# EAGLE design MD_02_SCHM (EAGLE 9.5.1)
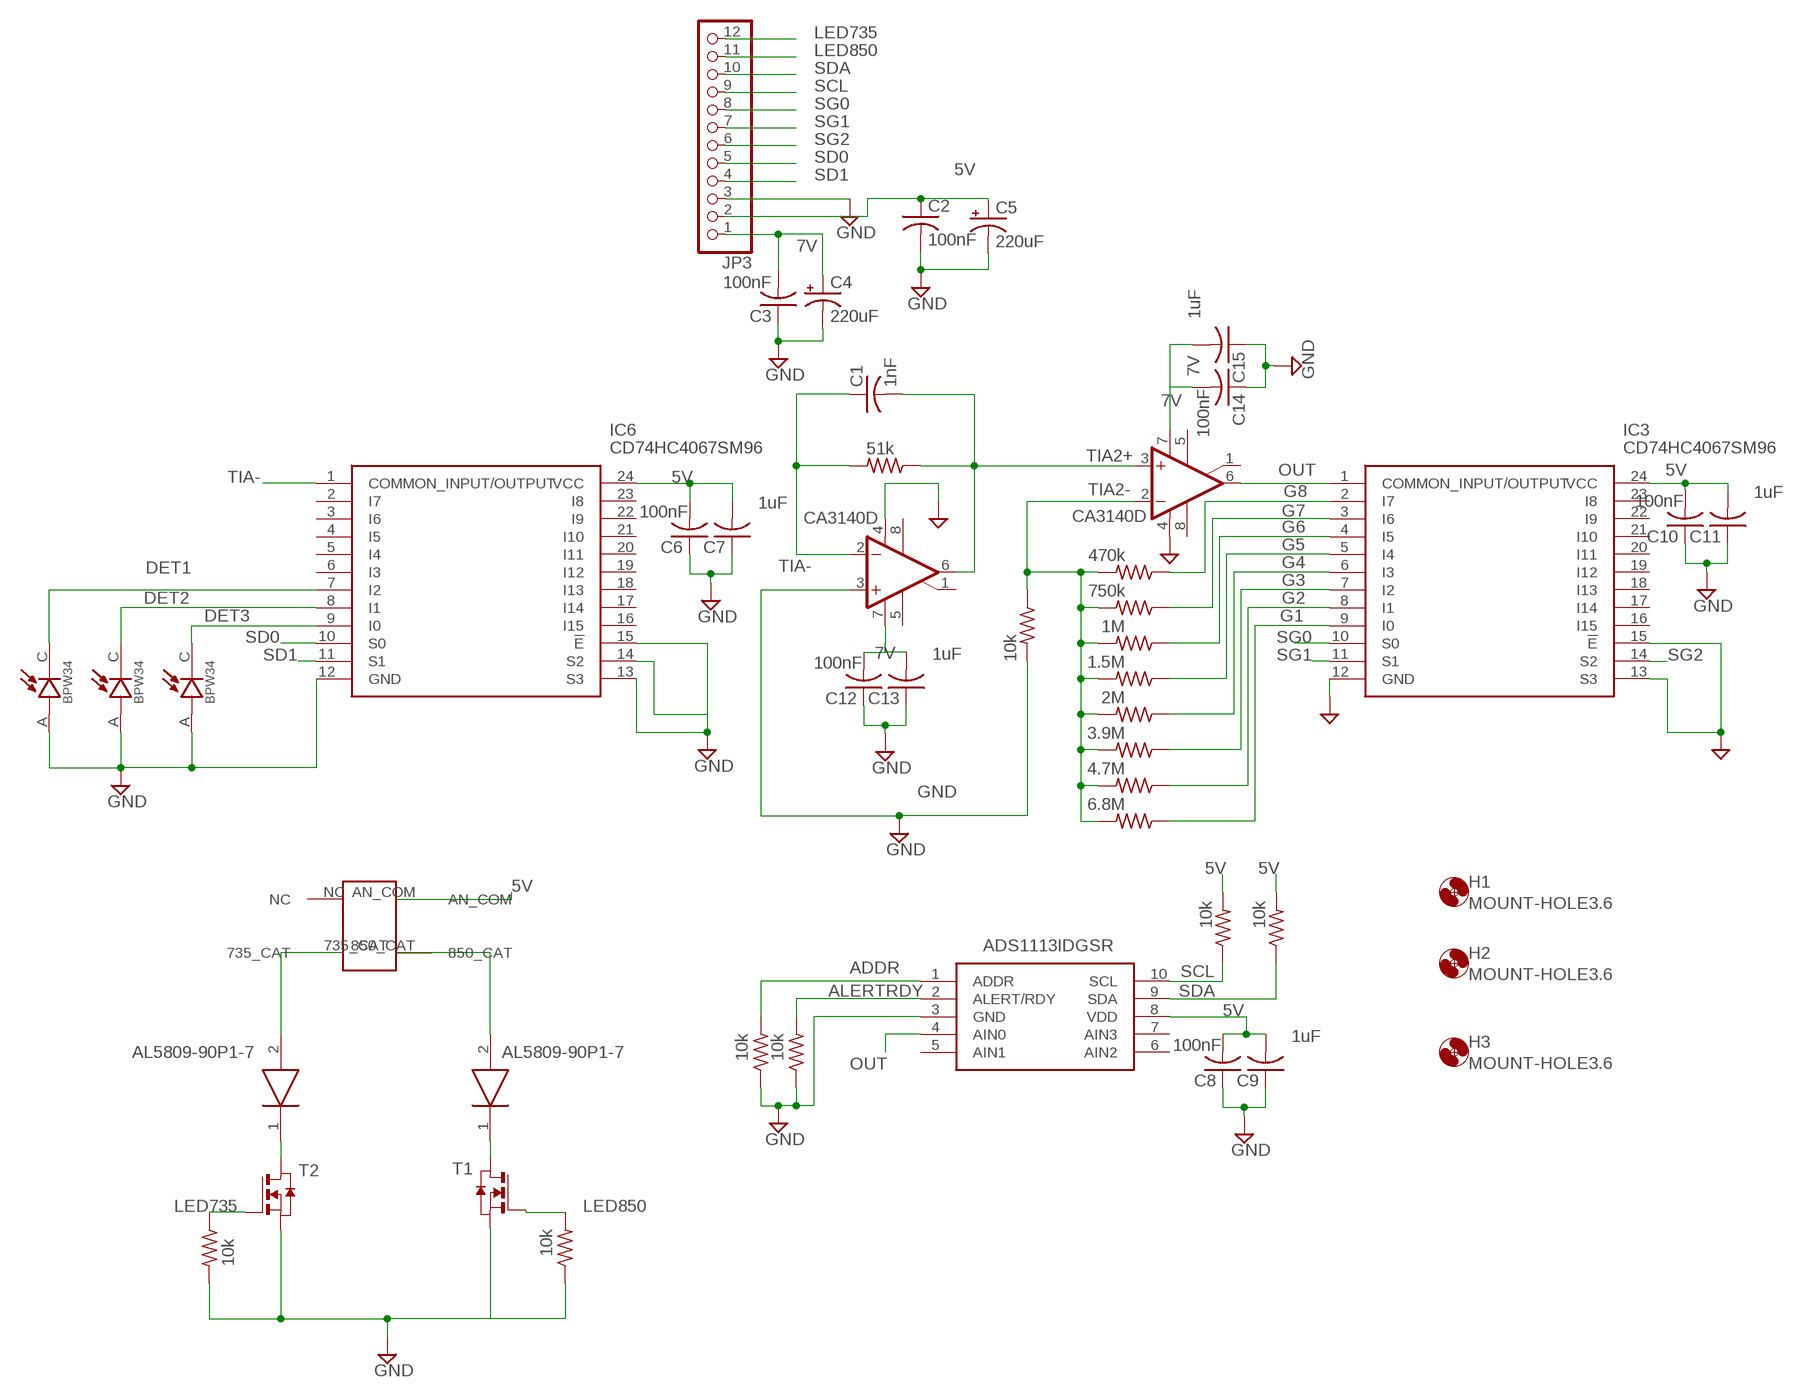
[diagram p0: schematic, sheet 1]

## Parts
C1  1nF  C-USC0805  [C0805]
C2  100nF  C-USC0805  [C0805]
C3  100nF  C-USC0805  [C0805]
C4  220uF  CPOL-USE5-6  [E5-6]
C5  220uF  CPOL-USE5-6  [E5-6]
C6  100nF  C-USC0805  [C0805]
C7  1uF  C-USC0805  [C0805]
C8  100nF  C-USC0805  [C0805]
C9  1uF  C-USC0805  [C0805]
C10  100nF  C-USC0805  [C0805]
C11  1uF  C-USC0805  [C0805]
C12  100nF  C-USC0805  [C0805]
C13  1uF  C-USC0805  [C0805]
C14  100nF  C-USC0805  [C0805]
C15  1uF  C-USC0805  [C0805]
D1  AL5809-90P1-7  [SODFL3718X100N]
D2  BPW34  [DIO_BPW34]
D3  BPW34  [DIO_BPW34]
D4  BPW34  [DIO_BPW34]
D5  AL5809-90P1-7  [SODFL3718X100N]
H1  MOUNT-HOLE3.6  [3,6]
H2  MOUNT-HOLE3.6  [3,6]
H3  MOUNT-HOLE3.6  [3,6]
IC1  CA3140D  [SO08]
IC2  CA3140D  [SO08]
IC3  CD74HC4067SM96  [SOP65P780X200-24N]
IC5  ADS1113IDGSR  [SOP50P490X110-10N]
IC6  CD74HC4067SM96  [SOP65P780X200-24N]
JP3  PINHD-1X12  [1X12]
R1  51k  R-US_R0805  [R0805]
R2  10k  R-US_R0805  [R0805]
R3  470k  R-US_R0805  [R0805]
R4  750k  R-US_R0805  [R0805]
R5  1M  R-US_R0805  [R0805]
R6  1.5M  R-US_R0805  [R0805]
R7  2M  R-US_R0805  [R0805]
R8  3.9M  R-US_R0805  [R0805]
R9  4.7M  R-US_R0805  [R0805]
R10  6.8M  R-US_R0805  [R0805]
R11  10k  R-US_R0805  [R0805]
R12  10k  R-US_R0805  [R0805]
R13  10k  R-US_R0805  [R0805]
R14  10k  R-US_R0805  [R0805]
R15  10k  R-US_R0805  [R0805]
R16  10k  R-US_R0805  [R0805]
T1  NMOSSOT23  [SOT-23]
T2  NMOSSOT23  [SOT-23]
U$1  SMT735D_850D  [SMT735D_850D]

## Nets
5V: C2.1 C5.+ C6.2 C7.2 C8.2 C9.2 C10.2 C11.2 IC3.24(VCC) IC5.8(VDD) IC6.24(VCC) JP3.2 R13.2 R14.2 U$1.AN_COM
7V: C3.2 C4.+ C12.2 C13.2 C14.2 C15.2 IC1.7(V+) IC2.7(V+) JP3.1
ADDR: IC5.1(ADDR) R11.2
ALERTRDY: IC5.2(ALERT/RDY) R12.2
DET1: D2.C IC6.7(I2)
DET2: D3.C IC6.8(I1)
DET3: D4.C IC6.9(I0)
G1: IC3.9(I0) R10.1
G2: IC3.8(I1) R9.1
G3: IC3.7(I2) R8.1
G4: IC3.6(I3) R7.1
G5: IC3.5(I4) R6.1
G6: IC3.4(I5) R5.1
G7: IC3.3(I6) R4.1
G8: IC3.2(I7) R3.1
GND: C2.2 C3.1 C4.- C5.- C6.1 C7.1 C8.1 C9.1 C10.1 C11.1 C12.1 C13.1 C14.1 C15.1 D2.A D3.A D4.A IC1.3(+IN) IC1.4(V-) IC2.4(V-) IC3.12(GND) IC3.13(S3) IC3.15(!E) IC5.3(GND) IC6.12(GND) IC6.13(S3) IC6.14(S2) IC6.15(!E) JP3.3 R2.2 R11.1 R12.1 R15.2 R16.1 T1.2(S) T2.2(S)
LED735: JP3.12 R15.1 T2.3(G)
LED850: JP3.11 R16.2 T1.3(G)
N$1: D5.1(K) T2.1(D)
N$2: D1.1(K) T1.1(D)
N$3: D1.2(A) U$1.850_CAT
N$4: D5.2(A) U$1.735_CAT
OUT: IC2.6(OUT) IC3.1(COMMON_INPUT/OUTPUT) IC5.4(AIN0)
SCL: IC5.10(SCL) JP3.9 R13.1
SD0: IC6.10(S0) JP3.5
SD1: IC6.11(S1) JP3.4
SDA: IC5.9(SDA) JP3.10 R14.1
SG0: IC3.10(S0) JP3.8
SG1: IC3.11(S1) JP3.7
SG2: IC3.14(S2) JP3.6
TIA2+: C1.2 IC1.6(OUT) IC2.3(+IN) R1.1
TIA2-: IC2.2(-IN) R2.1 R3.2 R4.2 R5.2 R6.2 R7.2 R8.2 R9.2 R10.2
TIA-: C1.1 IC1.2(-IN) IC6.1(COMMON_INPUT/OUTPUT) R1.2
Unconnected: IC1.1(ON/CMP) IC1.5(ON) IC1.8(CMP) IC2.1(ON/CMP) IC2.5(ON) IC2.8(CMP) IC3.16(I15) IC3.17(I14) IC3.18(I13) IC3.19(I12) IC3.20(I11) IC3.21(I10) IC3.22(I9) IC3.23(I8) IC5.5(AIN1) IC5.6(AIN2) IC5.7(AIN3) IC6.2(I7) IC6.3(I6) IC6.4(I5) IC6.5(I4) IC6.6(I3) IC6.16(I15) IC6.17(I14) IC6.18(I13) IC6.19(I12) IC6.20(I11) IC6.21(I10) IC6.22(I9) IC6.23(I8) U$1.NC

## Library data of the parts
C1-C3 C6-C15 = rcl:C-US: CAPACITOR, American symbol; SPICEPREFIX: C
C4 C5 = rcl:CPOL-US: POLARIZED CAPACITOR, American symbol; SPICEPREFIX: C
D1 D5 = AL5809-90P1-7:AL5809-90P1-7: 60V Two Terminal LED Driver PowerDI 123 DiodesZetex AL5809-90P1-7 LED Driver IC, 60 V 94.5mA 2-Pin PDI-123 Source: Datasheet <https://www.diodes.com/assets/Datasheets/AL5809.pdf>; ARROW_PART_NUMBER: AL5809-90P1-7; ARROW_PRICE-STOCK: https://www.arrow.com/en/products/al5809-90p1-7/diodes-incorporated; DESCRIPTION: 60V Two Terminal LED Driver PowerDI 123 DiodesZetex AL5809-90P1-7 LED Driver IC, 60 V 94.5mA 2-Pin PDI-123; HEIGHT: 1mm; MANUFACTURER_NAME: Diodes Inc.; MANUFACTURER_PART_NUMBER: AL5809-90P1-7; MOUSER_PART_NUMBER: 621-AL5809-90P1-7; MOUSER_PRICE-STOCK: https://www.mouser.co.uk/ProductDetail/Diodes-Incorporated/AL5809-90P1-7?qs=9BjnSzo86S8buMV1uNzOdA%3D%3D
D2-D4 = BPW34:BPW34: PIN IR photodiode; DIL; 400-1100nm; 150mW; 60°; λp max:; AVAILABILITY: Unavailable; DESCRIPTION: Photodiode 900nm 130° 2-DIP; MF: Vishay Semiconductor; MP: BPW34; PACKAGE: DIP-2 Osram Opto; PRICE: None
H1-H3 = holes:MOUNT-HOLE: MOUNTING HOLE with drill center marker
IC1 IC2 = linear:CA3140: OP AMP
IC3 IC6 = CD74HC4067SM96:CD74HC4067SM96: High Speed CMOS 16-Ch MUX/DEMUX 24P SOIC CD74HC4067SM96, Multiplexer/Demultiplexer Single 16:1, 3 V, 5 V, 24-Pin, SSOP, 1 Source: Datasheet <http://docs-emea.rs-online.com/webdocs/0c95/0900766b80c95708.pdf>; ARROW_PART_NUMBER: CD74HC4067SM96; ARROW_PRICE-STOCK: https://www.arrow.com/en/products/cd74hc4067sm96/texas-instruments?region=nac; DESCRIPTION: High Speed CMOS 16-Ch MUX/DEMUX 24P SOIC CD74HC4067SM96, Multiplexer/Demultiplexer Single 16:1, 3 V, 5 V, 24-Pin, SSOP, 1; HEIGHT: 2mm; MANUFACTURER_NAME: Texas Instruments; MANUFACTURER_PART_NUMBER: CD74HC4067SM96; MOUSER_PART_NUMBER: 595-CD74HC4067SM96; MOUSER_PRICE-STOCK: https://www.mouser.co.uk/ProductDetail/Texas-Instruments/CD74HC4067SM96?qs=JHHQeKcAU3DyfvAOSRLjhQ%3D%3D
IC5 = ADS1113IDGSR:ADS1113IDGSR: 16-Bit 860SPS 1-Ch Delta-Sigma ADC With Oscillator, Voltage Reference, and I2C Source: Datasheet <http://www.ti.com/lit/gpn/ADS1113>; ARROW_PART_NUMBER: ADS1113IDGSR; ARROW_PRICE-STOCK: https://www.arrow.com/en/products/ads1113idgsr/texas-instruments; DESCRIPTION: 16-Bit 860SPS 1-Ch Delta-Sigma ADC With Oscillator, Voltage Reference, and I2C; HEIGHT: 1.1mm; MANUFACTURER_NAME: Texas Instruments; MANUFACTURER_PART_NUMBER: ADS1113IDGSR; MOUSER_PART_NUMBER: 595-ADS1113IDGSR; MOUSER_PRICE-STOCK: https://www.mouser.co.uk/ProductDetail/Texas-Instruments/ADS1113IDGSR?qs=IK5e5L0zOXhAIF5uflVd8Q%3D%3D
JP3 = pinhead:PINHD-1X12: PIN HEADER
R1-R16 = rcl:R-US_: RESISTOR, American symbol; SPICEPREFIX: R
T1 T2 = zetex:NMOSSOT23: MOS FET; OC_FARNELL: unknown; OC_NEWARK: unknown
U$1 = SMT735D_850D:SMT735D_850D

## Board
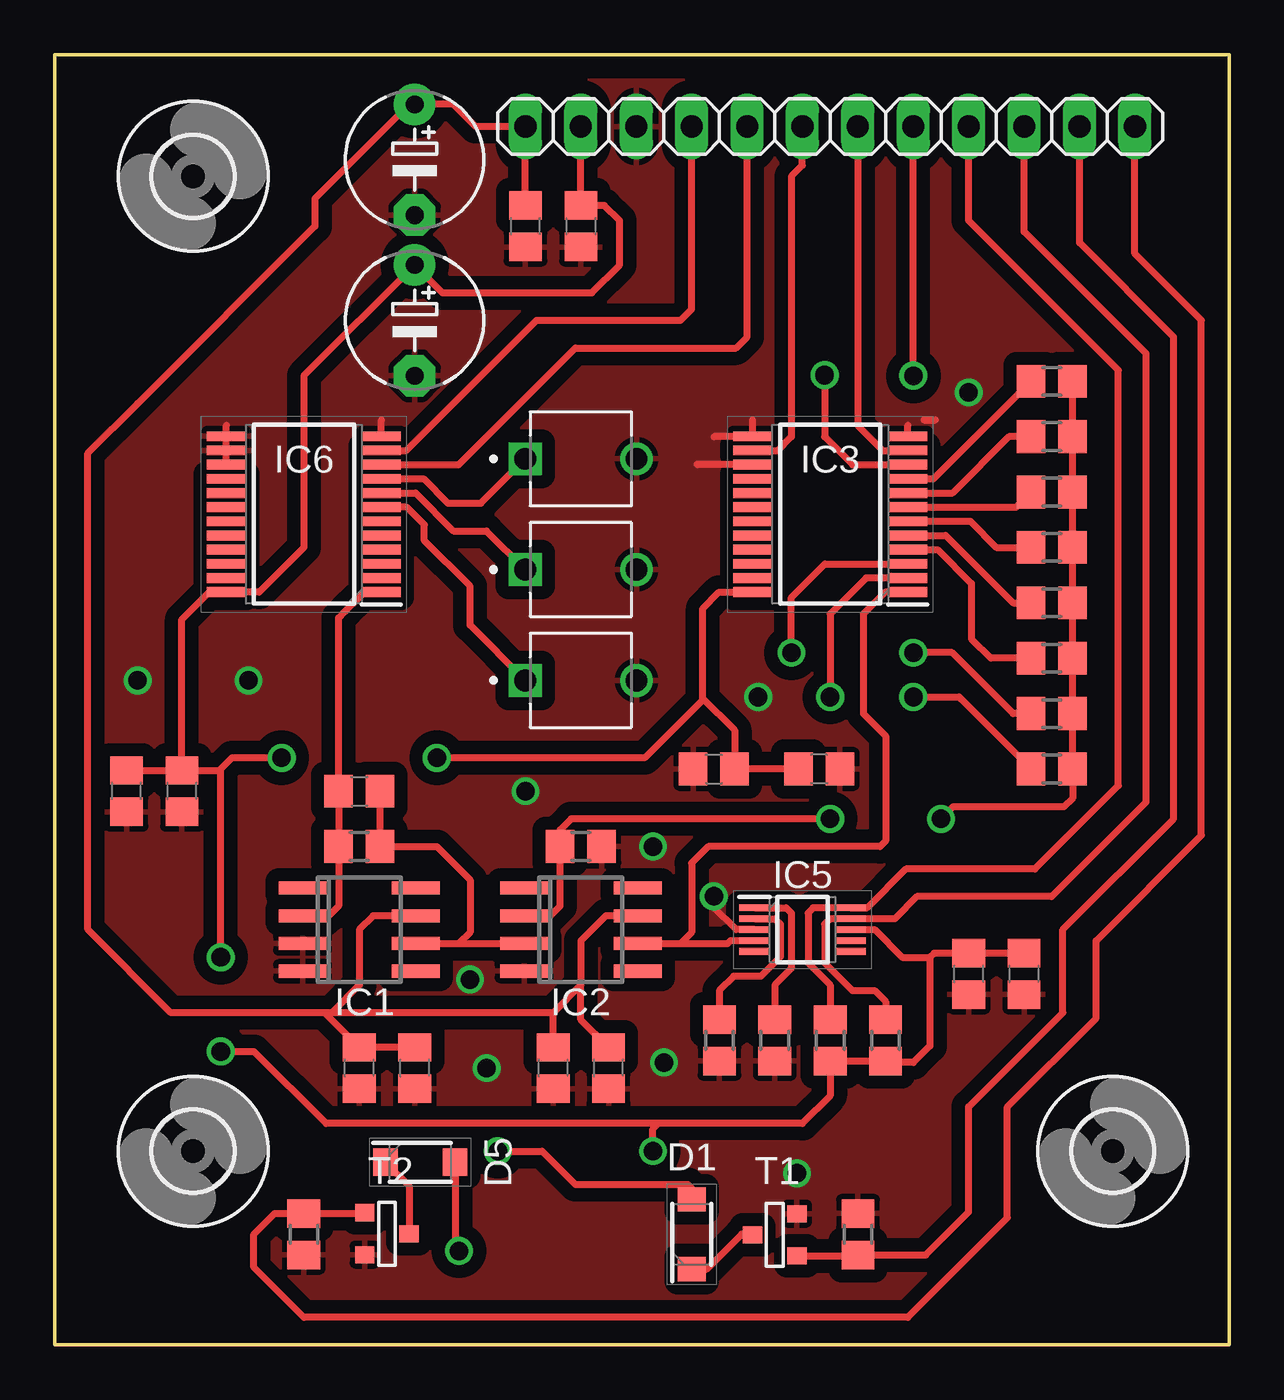
[diagram p1: board, top side]
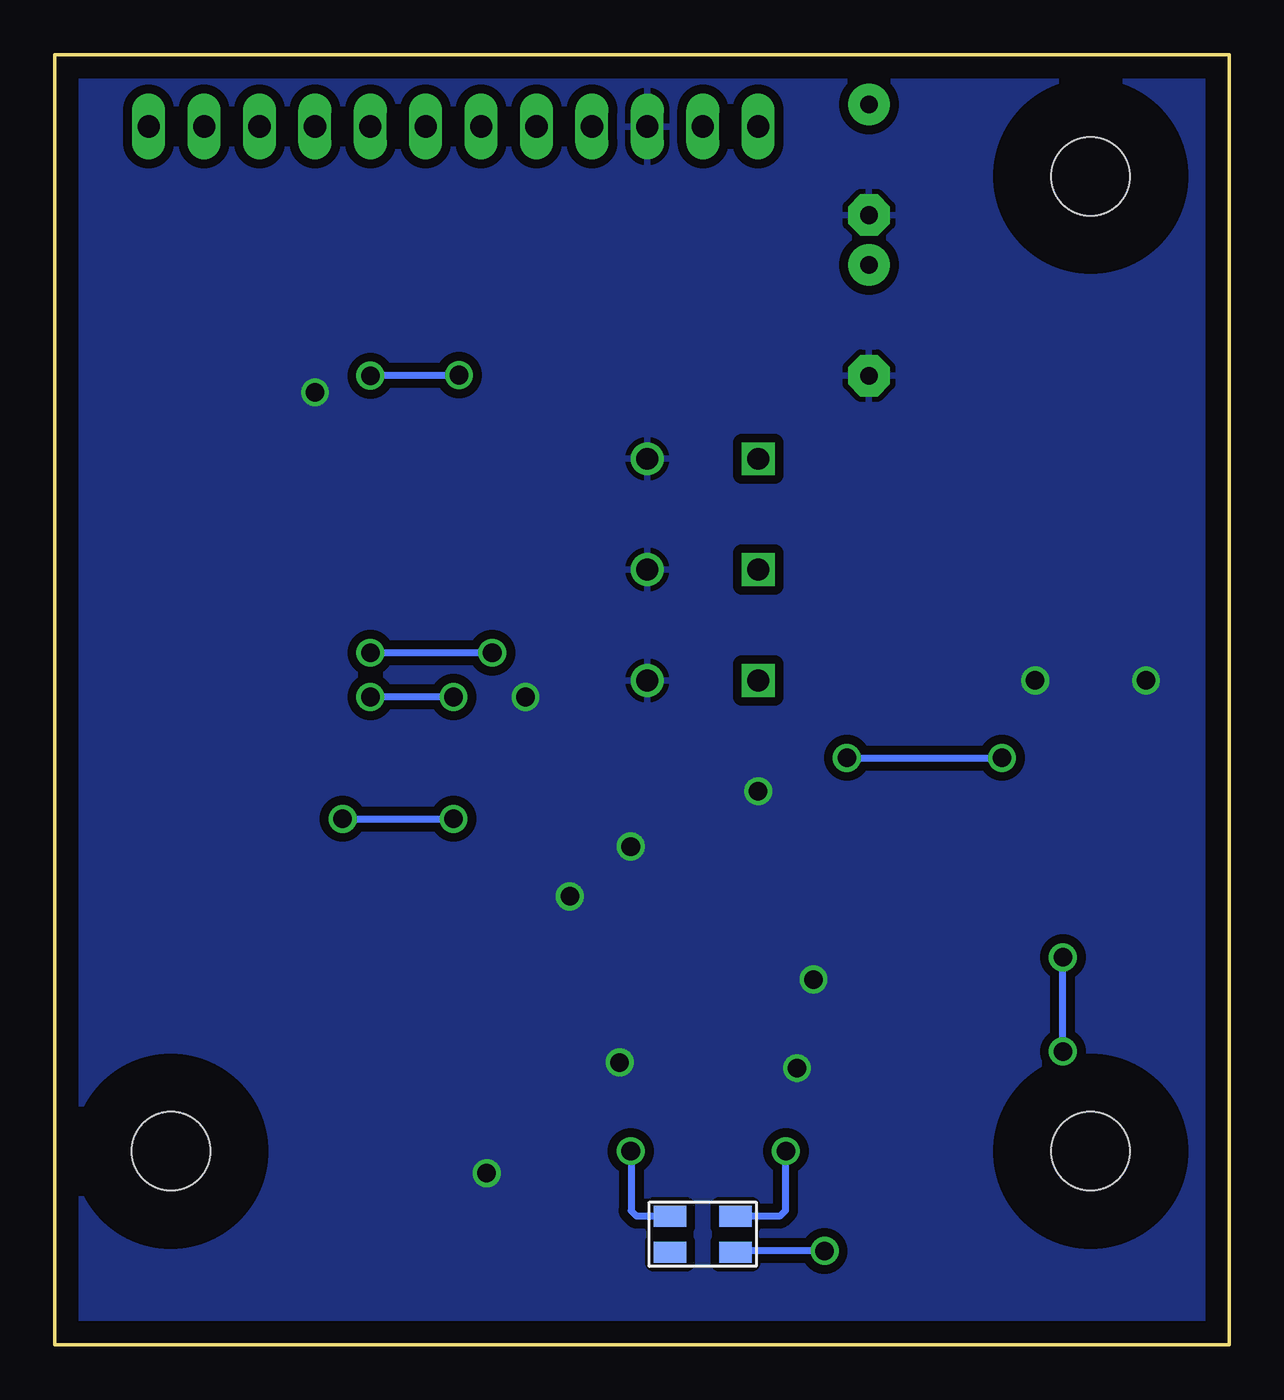
[diagram p2: board, bottom side, seen from below]

Size 53.85 x 59.18 mm. Coordinates in mm from the lower left corner, seen from the top.
Outline: 0,0 53.85,0 53.85,59.18 0,59.18 0,0
Copper layers (1*16): Top 0.035mm / dielectric 1.5mm / Bottom 0.035mm
Design rules "default": minimum track width 6mil, minimum drill 0.35mm, track to track 6mil, track to pad 6mil, pad to pad 6mil, via to via 6mil, smd to smd 6mil, copper to edge 40mil, drill to drill 6mil, minimum pad ring 10mil, minimum via ring 8mil, stop-mask expansion 4mil, vias tented up to drill 0mil, thermal gap 10mil

### Footprints (pad centres in the part's own frame; a part is rotated, then mirrored left to right if it is on the bottom)
C0805 = smd 1.3 x 1.5: 1 -0.95,0; 2 0.95,0
E5-6 = drill 0.813 pad 1.905: + -2.54,0 | drill 0.813 pad 1.905 octagon: - 2.54,0
SODFL3718X100N = smd 1.12 x 1.27: 1 -1.6,0; 2 1.6,0
DIO_BPW34 = drill 1 pad 1.5: A 2.55,0 | drill 1 pad 1.5 square: C -2.55,0
3,6 = hole 3.6: 0,0
SO08 = smd 0.6 x 2.2: 1 -1.905,-2.6; 2 -0.635,-2.6; 3 0.635,-2.6; 4 1.905,-2.6; 5 1.905,2.6; 6 0.635,2.6; 7 -0.635,2.6; 8 -1.905,2.6
SOP65P780X200-24N = smd 1.8 x 0.45: 1 -3.55,3.575; 2 -3.55,2.925; 3 -3.55,2.275; 4 -3.55,1.625; 5 -3.55,0.975; 6 -3.55,0.325; 7 -3.55,-0.325; 8 -3.55,-0.975; 9 -3.55,-1.625; 10 -3.55,-2.275; 11 -3.55,-2.925; 12 -3.55,-3.575; 13 3.55,-3.575; 14 3.55,-2.925; 15 3.55,-2.275; 16 3.55,-1.625; 17 3.55,-0.975; 18 3.55,-0.325; 19 3.55,0.325; 20 3.55,0.975; 21 3.55,1.625; 22 3.55,2.275; 23 3.55,2.925; 24 3.55,3.575
SOP50P490X110-10N = smd 1.4 x 0.3: 1 -2.2,1; 2 -2.2,0.5; 3 -2.2,0; 4 -2.2,-0.5; 5 -2.2,-1; 6 2.2,-1; 7 2.2,-0.5; 8 2.2,0; 9 2.2,0.5; 10 2.2,1
1X12 = drill 1.016 long: 1 -13.97,0; 2 -11.43,0; 3 -8.89,0; 4 -6.35,0; 5 -3.81,0; 6 -1.27,0; 7 1.27,0; 8 3.81,0; 9 6.35,0; 10 8.89,0; 11 11.43,0; 12 13.97,0
R0805 = smd 1.3 x 1.5: 1 -0.95,0; 2 0.95,0
SOT-23 = smd 0.787 x 0.889: 1 0.025,-1.016; 2 -0.94,1.016; 3 0.991,1.016
SMT735D_850D = smd 0.95 x 1.5: 735_CAT -0.825,-1.497; 850_CAT 0.825,-1.497; AN_COM 0.825,1.503; NC -0.825,1.503

### Placement (x,y rotation side)
C1  13.97,25.4 0 top
C2  24.13,51.31 270 top
C3  21.59,51.31 90 top
C4  16.51,54.36 270 top
C5  16.51,46.99 270 top
C6  5.84,25.4 90 top
C7  3.3,25.4 90 top
C8  41.91,17.02 90 top
C9  44.45,17.02 90 top
C10  30.23,26.42 0 top
C11  35.05,26.42 180 top
C12  16.51,12.7 90 top
C13  13.97,12.7 90 top
C14  25.4,12.7 90 top
C15  22.86,12.7 90 top
D1  29.21,5.08 90 top
D2  24.13,30.48 0 top
D3  24.13,35.56 0 top
D4  24.13,40.64 0 top
D5  16.76,8.38 0 top
H1  48.51,8.89 0 top
H2  6.35,8.89 0 top
H3  6.35,53.59 0 top
IC1  13.97,19.05 270 top
IC2  24.13,19.05 270 top
IC3  35.56,38.1 180 top
IC5  34.29,19.05 0 top
IC6  11.43,38.1 180 top
JP3  35.56,55.88 0 top
R1  13.97,22.86 180 top
R2  24.13,22.86 0 top
R3  45.72,26.42 0 top
R4  45.72,28.96 0 top
R5  45.72,31.5 0 top
R6  45.72,34.04 0 top
R7  45.72,36.58 0 top
R8  45.72,39.12 0 top
R9  45.72,41.66 0 top
R10  45.72,44.2 0 top
R11  33.02,13.97 90 top
R12  30.48,13.97 90 top
R13  35.56,13.97 270 top
R14  38.1,13.97 270 top
R15  11.43,5.08 270 top
R16  36.83,5.08 270 top
T1  33.02,5.08 270 top
T2  15.24,5.08 90 top
U$1  24.13,5.08 90 bottom

### Tracks (layer width: path | path; a pad name or v marks a point on that pad's centre or on a via)
5V  (via drill 0.85 pad 1.15)
  Top 0.33: 40.13,17.78 40.13,13.72 39.37,12.95 38.17,12.95 R14.2 R13.2 35.56,11.43 34.29,10.16 27.69,10.16 | 27.69,10.16 12.45,10.16 9.14,13.46 v7.62,13.46 | v7.62,17.78 7.62,26.42 | v17.53,26.92 27.05,26.92 29.72,29.59 29.72,29.65 | v10.41,26.92 8.13,26.92 7.62,26.42 | C9.2 C8.2 40.32,17.97 40.13,17.78 | C11.2 C10.2 31.18,28.19 29.72,29.65 | C7.2 C6.2 | JP3.2 C2.1 25.21,52.26 25.91,51.56 25.91,49.53 24.64,48.26 17.78,48.26 C5.+ 11.43,44.45 11.43,36.58 9.38,34.52 IC6.24 7.86,34.54 7.11,34.54 5.84,33.27 C6.2 | C6.2 7.55,26.35 7.62,26.42 | 29.72,29.65 29.72,33.78 30.46,34.52 IC3.24 | v27.43,8.89 27.43,9.91 27.69,10.16 | IC5.8 37.59,19.05 38.86,17.78 40.13,17.78
  Bottom 0.33: v7.62,13.46 v7.62,17.78 | U$1.AN_COM 27.16,5.91 27.41,6.16 27.41,8.87 v27.43,8.89 | v17.53,26.92 v10.41,26.92
7V
  Top 0.33: IC2.7 25.27,19.68 24.13,18.54 24.13,16.51 | IC1.7 14.61,19.68 13.97,19.05 13.97,16.51 12.7,15.24 | 12.7,15.24 12.38,15.24 | 12.38,15.24 5.33,15.24 1.52,19.05 1.52,40.89 3.81,43.18 | 24.13,16.51 22.86,15.24 | 22.86,15.24 12.7,15.24 | C14.2 24.13,14.92 24.13,16.51 | C15.2 22.86,15.24 | C12.2 C13.2 12.38,15.24 | 3.81,43.18 11.94,51.31 11.94,52.58 16.26,56.9 C4.+ 18.29,56.9 19.3,55.88 JP3.1 C3.2 | 3.81,43.18
ADDR
  Top 0.33: IC5.1 33.54,20.05 33.78,19.81 33.78,17.27 33.02,16.51 R11.2
ALERTRDY
  Top 0.33: IC5.2 33.03,19.55 33.27,19.3 33.27,17.81 32.38,16.91 31.13,16.91 30.48,16.26 R12.2
DET1
  Top 0.33: D2.C 19.05,33.01 19.05,34.8 16.96,36.89 16.96,37.62 16.16,38.42 IC6.7
DET2
  Top 0.33: IC6.8 16.55,39.08 18.29,37.34 19.8,37.34 D3.C
DET3
  Top 0.33: IC6.9 16.92,39.73 18.03,38.61 19.55,38.61 D4.C
G1
  Top 0.33: R10.1 41.91,41.34 40.3,39.73 IC3.9
G2
  Top 0.33: R9.1 43.75,41.66 41.17,39.08 IC3.8
G3
  Top 0.33: IC3.7 44.08,38.42 R8.1
G4
  Top 0.33: IC3.6 41.98,37.77 43.18,36.58 R7.1
G5
  Top 0.33: 44.39,33.66 R6.1 43.94,34.04 40.85,37.12 IC3.5
G6
  Top 0.33: R5.1 42.93,31.5 42.04,32.38 42.04,34.92 40.49,36.48 IC3.4
G7  (via drill 0.85 pad 1.15)
  Top 0.33: R4.1 43.94,28.96 41.15,31.75 v39.37,31.75 | v33.78,31.75 33.78,34.29 35.32,35.83 IC3.3
  Bottom 0.33: v39.37,31.75 v33.78,31.75
G8  (via drill 0.85 pad 1.15)
  Top 0.33: R3.1 41.56,29.62 41.47,29.72 v39.37,29.72 | IC3.2 37.21,35.17 35.56,33.53 v35.56,29.72
  Bottom 0.33: v35.56,29.72 v39.37,29.72
GND  (via drill 0.85, 0.85 pad 1.15)
  Top 0.33: IC5.3 31.24,19.05 30.23,20.07 v30.23,20.57 | IC3.15 29.48,40.38 29.46,40.39 | 30.23,41.66 31.99,41.66 IC3.13 32,42.42 | 39.85,42.42 40.39,42.42 | IC6.15 IC6.14 IC6.13 7.88,42.17 | IC6.12 14.98,42.41 14.99,42.42 | IC3.12 39.11,42.16 39.12,42.16
  other vias: 34.04,7.87 27.94,12.95 27.43,22.86 8.89,30.48 3.81,30.48 41.91,43.69 32.26,29.72 21.59,25.4 19.81,12.7 19.05,16.76
  pour Bottom (isolate 0.406): -6.35,68.58 57.15,68.58 57.15,-2.54 -6.35,-2.54
  pour Top (isolate 0.61): -11.43,60.96 59.69,60.96 59.69,-5.08 -11.43,-5.08
LED735
  Top 0.33: T2.3 14.18,6.03 R15.1 10.09,6.03 9.14,5.08 9.14,3.56 11.43,1.27 39.12,1.27 43.69,5.84 43.69,10.92 47.75,14.99 47.75,18.54 52.58,23.37 52.58,46.99 49.53,50.04 JP3.12
LED850
  Top 0.33: T1.3 36.79,4.09 R16.2 39.94,4.13 41.91,6.1 41.91,10.92 46.23,15.24 46.23,19.05 51.31,24.13 51.31,46.23 46.99,50.55 JP3.11
N$1
  Top 0.33: D5.1 16.26,7.29 T2.1
N$2
  Top 0.33: D1.1 29.9,3.48 31.5,5.08 31.98,5.08 T1.1
N$3  (via drill 0.85 pad 1.15)
  Top 0.33: D1.2 29.21,7.19 29.03,7.37 23.88,7.37 22.35,8.89 v20.32,8.89
  Bottom 0.33: v20.32,8.89 20.35,8.86 20.35,6.16 20.6,5.91 U$1.850_CAT
N$4  (via drill 0.85 pad 1.15)
  Top 0.33: D5.2 18.36,4.5 v18.54,4.32
  Bottom 0.33: v18.54,4.32 22.57,4.32 U$1.735_CAT
OUT
  Top 0.33: IC2.6 28.7,18.41 | 28.7,18.41 30.86,18.41 31,18.55 IC5.4 | 28.7,18.41 29.21,18.92 29.21,22.1 29.97,22.86 37.85,22.86 38.1,23.11 38.1,27.94 37.08,28.96 37.08,33.53 38.08,34.52 IC3.1
SCL
  Top 0.33: R13.1 35.56,16.51 34.54,17.53 34.54,19.81 34.78,20.05 IC5.10 37.25,20.05 39.03,21.83 44.94,21.83 48.77,25.65 48.77,44.7 41.91,51.56 JP3.9
SD0
  Top 0.33: JP3.5 31.75,46.23 31.24,45.72 23.88,45.72 18.54,40.39 18.53,40.38 IC6.10
SD1
  Top 0.33: JP3.4 29.21,47.5 28.7,46.99 22.1,46.99 16.13,41.02 IC6.11
SDA
  Top 0.33: R14.1 38.1,15.75 37.59,16.26 36.58,16.26 35.31,17.53 35.31,19.3 35.55,19.55 IC5.9 38.52,19.55 39.54,20.57 45.71,20.57 50.04,24.89 50.04,45.47 44.45,51.05 JP3.10
SG0  (via drill 0.85 pad 1.15)
  Top 0.33: v39.37,44.45 JP3.8 | v35.31,44.48 35.31,41.66 36.59,40.38 IC3.10
  Bottom 0.33: v35.31,44.48 39.34,44.48 v39.37,44.45
SG1
  Top 0.33: IC3.11 37.97,41.02 36.83,42.16 JP3.7
SG2
  Top 0.33: JP3.6 34.29,54.1 33.78,53.59 33.78,41.66 33.15,41.02 IC3.14
TIA2+
  Top 0.33: C1.2 R1.1 17.53,22.86 19.05,21.34 19.05,18.92 18.54,18.41 | IC1.6 18.54,18.41 | 18.54,18.41 IC2.3
TIA2-  (via drill 0.85 pad 1.15)
  Top 0.33: IC2.2 22.73,19.68 23.18,20.13 R2.1 23.18,23.62 23.69,24.13 v35.56,24.13 | v40.64,24.13 41.18,24.68 46.28,24.68 46.67,25.07 R3.2 R4.2 R5.2 R6.2 R7.2 R8.2 R9.2 R10.2
  Bottom 0.33: v40.64,24.13 v35.56,24.13
TIA-
  Top 0.33: IC1.2 12.57,19.68 13.02,20.13 R1.2 C1.1 13.02,33.34 13.34,33.66 13.97,34.29 14.21,34.52 IC6.1